# Altium schematic sheet rasp_sheild_i2c.SchDoc
size Tabloid; SheetNumber: 4; SheetTotal: 5; Sheet_Name: Périphériques i2c; Size: 11x17
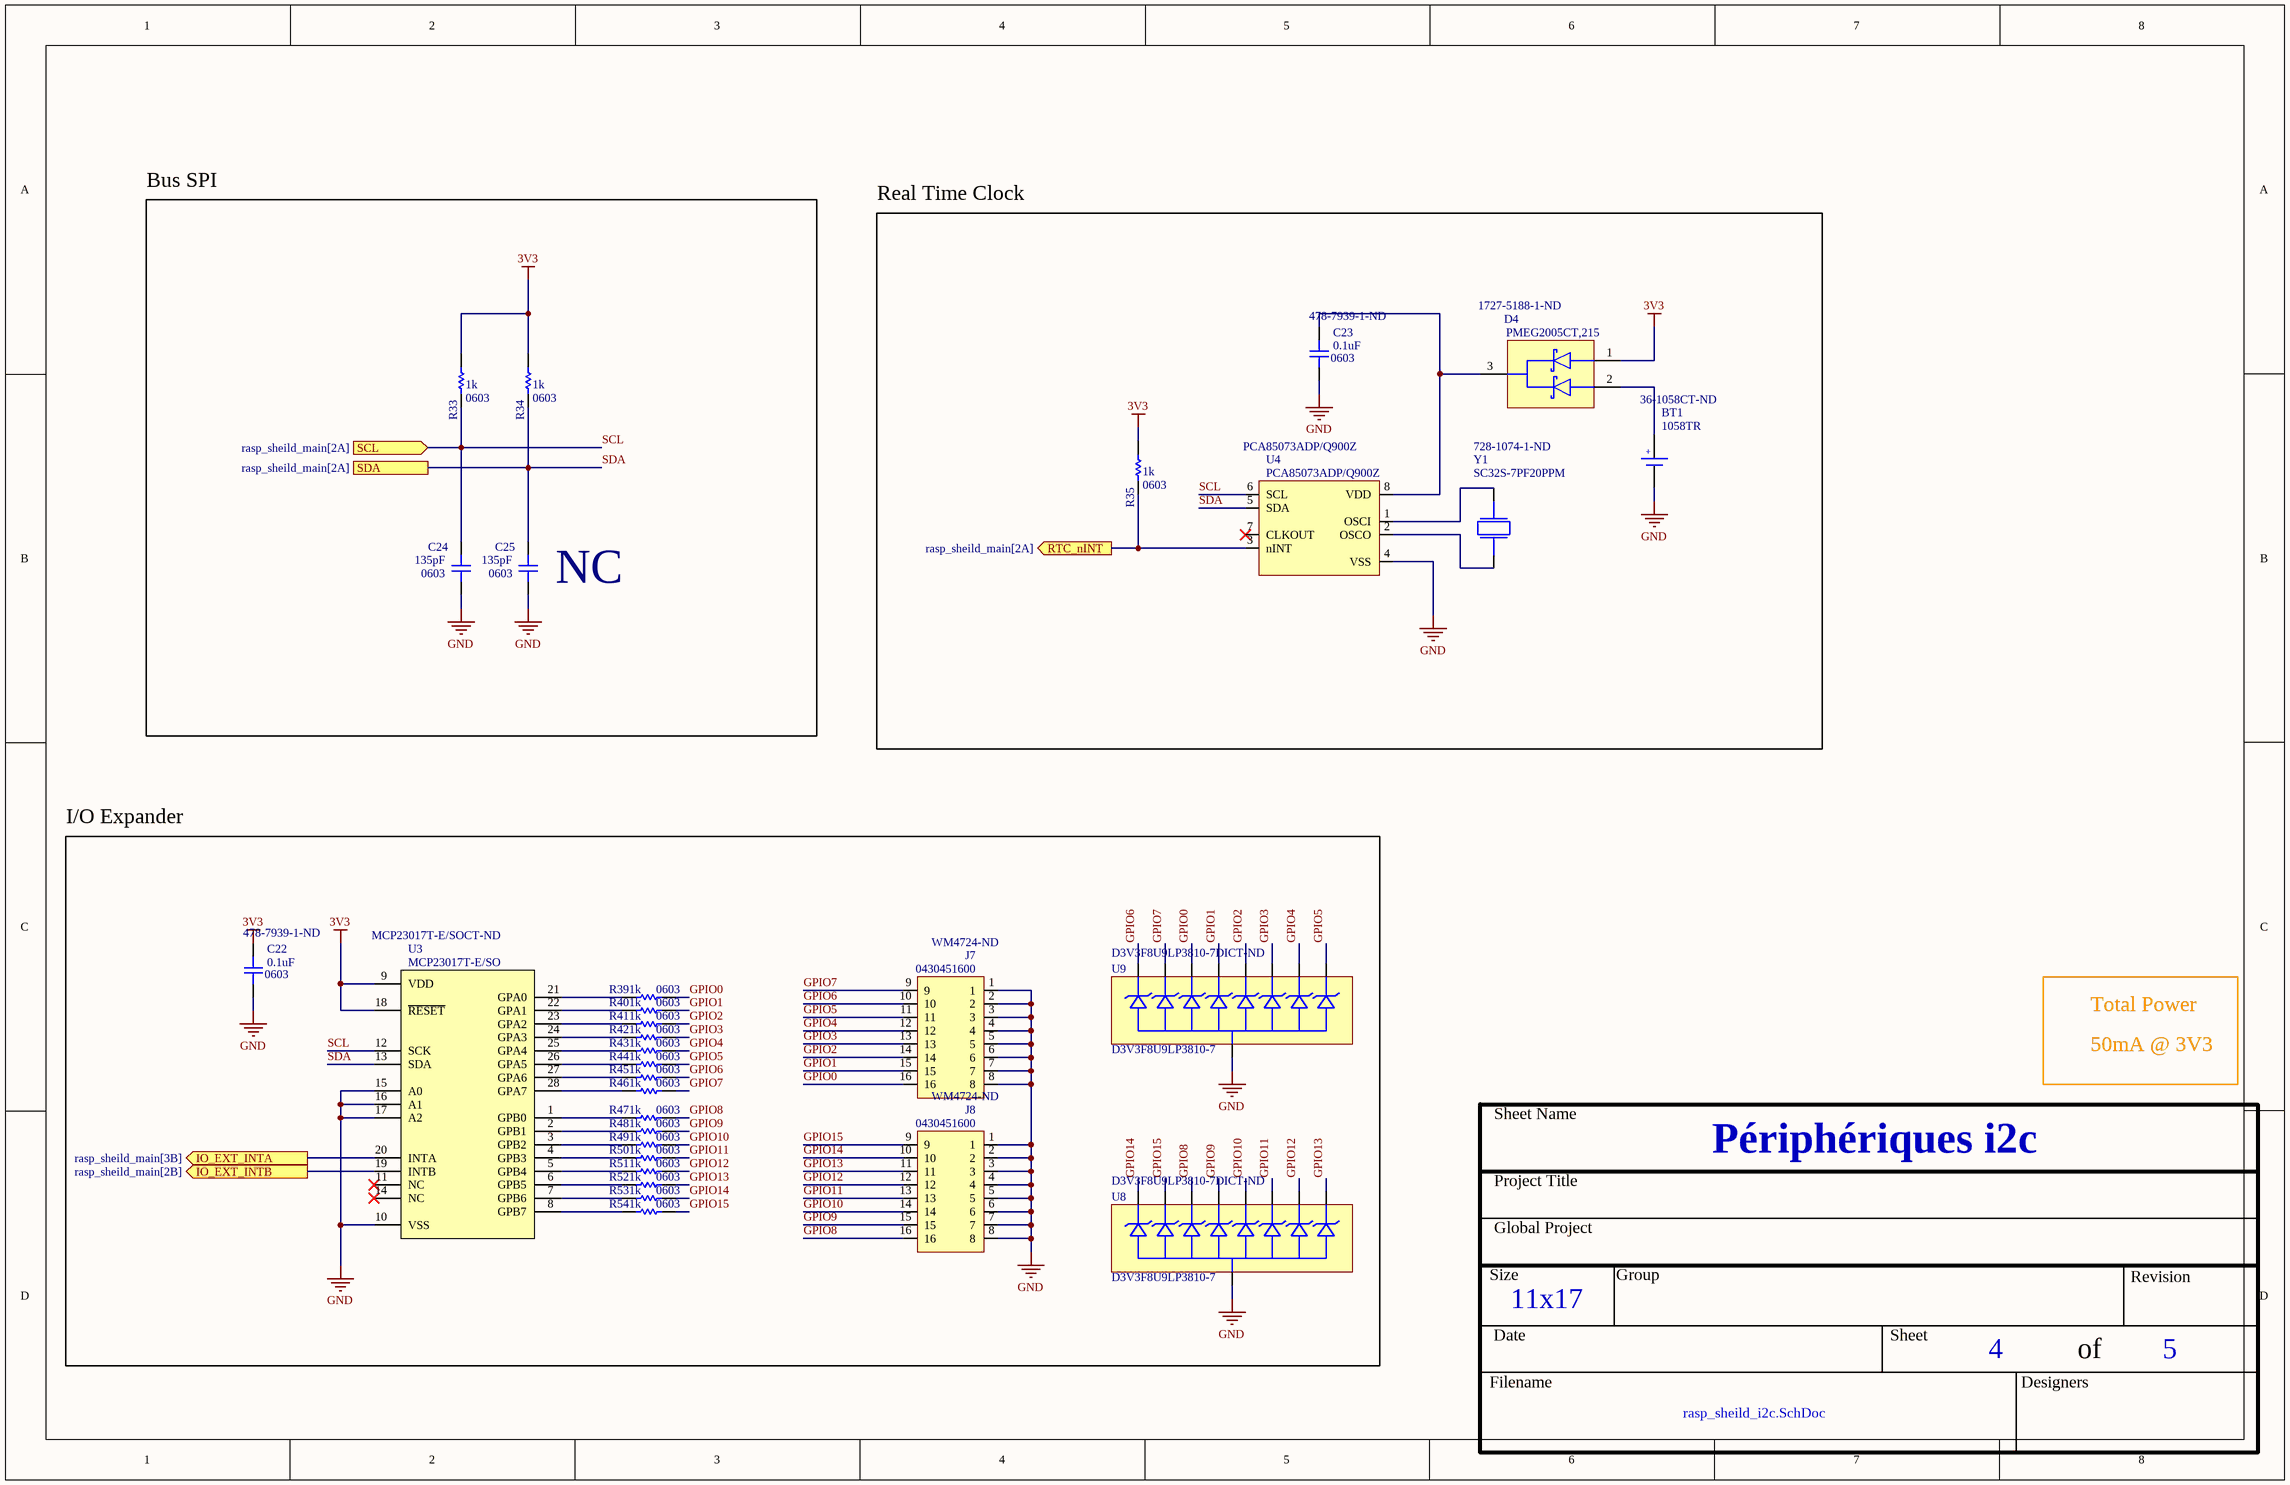
[diagram p0: rasp_sheild_i2c.SchDoc]

## Parts
BT1  1058TR  Supplier Part Number 1: 36-1058CT-ND  [1058TR]
C22  value 0.1uF  Package: 0603  Supplier Part Number 1: 478-7939-1-ND  [CAP_0603]  (hidden comment: Part Number)
C23  value 0.1uF  Package: 0603  Supplier Part Number 1: 478-7939-1-ND  [CAP_0603]  (hidden comment: Part Number)
C24  value 135pF  Package: 0603  [CAP_0603]  (hidden comment: Part Number)
C25  value 135pF  Package: 0603  [CAP_0603]  (hidden comment: Part Number)
D4  PMEG2005CT,215  Supplier Part Number 1: 1727-5188-1-ND  [SOT-23-3]
J7  0430451600  Supplier Part Number 1: WM4724-ND  [0430451600]
J8  0430451600  Supplier Part Number 1: WM4724-ND  [0430451600]
R33  value 1k  Package: 0603  [RES_0603]  (hidden comment: Part Number)
R34  value 1k  Package: 0603  [RES_0603]  (hidden comment: Part Number)
R35  value 1k  Package: 0603  [RES_0603]  (hidden comment: Part Number)
R39  value 1k  Package: 0603  [RES_0603]  (hidden comment: Part Number)
R40  value 1k  Package: 0603  [RES_0603]  (hidden comment: Part Number)
R41  value 1k  Package: 0603  [RES_0603]  (hidden comment: Part Number)
R42  value 1k  Package: 0603  [RES_0603]  (hidden comment: Part Number)
R43  value 1k  Package: 0603  [RES_0603]  (hidden comment: Part Number)
R44  value 1k  Package: 0603  [RES_0603]  (hidden comment: Part Number)
R45  value 1k  Package: 0603  [RES_0603]  (hidden comment: Part Number)
R46  value 1k  Package: 0603  [RES_0603]  (hidden comment: Part Number)
R47  value 1k  Package: 0603  [RES_0603]  (hidden comment: Part Number)
R48  value 1k  Package: 0603  [RES_0603]  (hidden comment: Part Number)
R49  value 1k  Package: 0603  [RES_0603]  (hidden comment: Part Number)
R50  value 1k  Package: 0603  [RES_0603]  (hidden comment: Part Number)
R51  value 1k  Package: 0603  [RES_0603]  (hidden comment: Part Number)
R52  value 1k  Package: 0603  [RES_0603]  (hidden comment: Part Number)
R53  value 1k  Package: 0603  [RES_0603]  (hidden comment: Part Number)
R54  value 1k  Package: 0603  [RES_0603]  (hidden comment: Part Number)
U3  MCP23017T-E/SO  Supplier Part Number 1: MCP23017T-E/SOCT-ND  [28-SOIC]
U4  PCA85073ADP/Q900Z  [8-MSOP]
U8  D3V3F8U9LP3810-7  Supplier Part Number 1: D3V3F8U9LP3810-7DICT-ND  [D3V3F8U9LP3810-7]
U9  D3V3F8U9LP3810-7  Supplier Part Number 1: D3V3F8U9LP3810-7DICT-ND  [D3V3F8U9LP3810-7]
Y1  SC32S-7PF20PPM  Supplier Part Number 1: 728-1074-1-ND  [SC32S-7PF20PPM]

## Blocks framed on the sheet
NC: C24 C25 R33 R34
Real Time Clock: BT1 C23 D4 R35 U4 Y1
I/O Expander: C22 J7 J8 R39-R54 U3 U8 U9

## Ports
IO_EXT_INTA (out, see rasp_sheild_main[3B]), IO_EXT_INTB (out, see rasp_sheild_main[2B]), RTC_nINT (out, see rasp_sheild_main[2A]), SCL (in, see rasp_sheild_main[2A]), SDA (see rasp_sheild_main[2A])

## Nets
3V3: C22.2 D4.1 R33.1 R34.1 R35.1 U3.9(VDD) U3.18(~{RESET})
GND: BT1.2(-) C22.1 C23.1 C24.1 C25.1 J7.1 J7.2 J7.3 J7.4 J7.5 J7.6 J7.7 J7.8 J8.1 J8.2 J8.3 J8.4 J8.5 J8.6 J8.7 J8.8 U3.10(VSS) U3.15(A0) U3.16(A1) U3.17(A2) U4.4(VSS) U8.3 U9.3
GPIO0: J7.16 R39.1 U9.4
GPIO1: J7.15 R40.1 U9.5
GPIO2: J7.14 R41.1 U9.6
GPIO3: J7.13 R42.1 U9.7
GPIO4: J7.12 R43.1 U9.8
GPIO5: J7.11 R44.1 U9.9
GPIO6: J7.10 R45.1 U9.1
GPIO7: J7.9 R46.1 U9.2
GPIO8: J8.16 R47.1 U8.4
GPIO9: J8.15 R48.1 U8.5
GPIO10: J8.14 R49.1 U8.6
GPIO11: J8.13 R50.1 U8.7
GPIO12: J8.12 R51.1 U8.8
GPIO13: J8.11 R52.1 U8.9
GPIO14: J8.10 R53.1 U8.1
GPIO15: J8.9 R54.1 U8.2
IO_EXT_INTA: U3.20(INTA) ; port IO_EXT_INTA
IO_EXT_INTB: U3.19(INTB) ; port IO_EXT_INTB
RTC_nINT: R35.2 U4.3(nINT) ; port RTC_nINT
SCL: C24.2 R33.2 U3.12(SCK) U4.6(SCL) ; port SCL
SDA: C25.2 R34.2 U3.13(SDA) U4.5(SDA) ; port SDA
NetBT1_1: BT1.1(+) D4.2
NetC23_2: C23.2 D4.3 U4.8(VDD)
NetR39_2: R39.2 U3.21(GPA0)
NetR40_2: R40.2 U3.22(GPA1)
NetR41_2: R41.2 U3.23(GPA2)
NetR42_2: R42.2 U3.24(GPA3)
NetR43_2: R43.2 U3.25(GPA4)
NetR44_2: R44.2 U3.26(GPA5)
NetR45_2: R45.2 U3.27(GPA6)
NetR46_2: R46.2 U3.28(GPA7)
NetR47_2: R47.2 U3.1(GPB0)
NetR48_2: R48.2 U3.2(GPB1)
NetR49_2: R49.2 U3.3(GPB2)
NetR50_2: R50.2 U3.4(GPB3)
NetR51_2: R51.2 U3.5(GPB4)
NetR52_2: R52.2 U3.6(GPB5)
NetR53_2: R53.2 U3.7(GPB6)
NetR54_2: R54.2 U3.8(GPB7)
NetU4_1: U4.1(OSCI) Y1.2
NetU4_2: U4.2(OSCO) Y1.1

Not connected (* = marked no-connect by the designer): U3 11(NC)* 14(NC)*; U4 7(CLKOUT)*

## Notes on the sheet
- Bus SPI
- Total Power
- 50mA @ 3V3
- Sheet Name
- Project Title
- Global Project
- Size
- Group
- Revision
- Date
- Sheet
- of
- Filename
- Designers

## Library data of the parts
BT1 = 1058TR: Battery Holder (Open) Coin, 20.0mm 1 Cell SMD (SMT) Tab; GRAMS Lib Spec: 2.7; Supplier 1: Digi-Key
C22-C25 = CAP_0603: XXX - Description - Package; GRAMS Lib Spec: 2.7
  C22 C23: Supplier 1: Digi-Key
D4 = PMEG2005CT,215: Diode Array 1 Pair Common Cathode 20 V 500mA Surface Mount TO-236-3, SC-59, SOT-23-3; GRAMS Lib Spec: 2.7; Supplier 1: Digi-Key
J7 J8 = 0430451600: Connector Header Through Hole, Right Angle 16 position 0.118" (3.00mm); GRAMS Lib Spec: 2.7; Supplier 1: Digi-Key
R33-R35 R39-R54 = RES_0603: XXX - Description - Package; GRAMS Lib Spec: 2.7; Supplier 1: Digi-Key; Supplier Part Number 1: 311-1.00KHRCT-ND
U3 = MCP23017T-E/SO: I/O Expander 16 I²C 1.7 MHz 28-SOIC; GRAMS Lib Spec: 2.7; Supplier 1: Digi-Key
U4 = PCA85073ADP/Q900Z: Real Time Clock (RTC) IC Clock/Calendar I²C 8-TSSOP, 8-MSOP (0.118", 3.00mm Width); GRAMS Lib Spec: 2.7; Supplier 1: Arrow Electronics; Supplier Part Number 1: PCA85073ADP/Q900Z
U8 U9 = D3V3F8U9LP3810-7: 5V (Typ) Clamp 5A (8/20µs) Ipp Tvs Diode Surface Mount U-DFN3810-9 (Type B); GRAMS Lib Spec: 2.7; Supplier 1: Digi-Key
Y1 = SC32S-7PF20PPM: 32.768 kHz ±20ppm Crystal 7pF 70 kOhms 2-SMD, No Lead; GRAMS Lib Spec: 2.7; Supplier 1: Digi-Key